# Altium schematic sheet AT long bus (13.3 x 4.2 inches).schdoc: AT long bus (13.3 x 4.2 inches)
size A4; Organization: Organization; Address1: Address1; Address2: Address2; Address3: Address3; Address4: Address4; DocumentNumber: 1; Revision: 0; SheetNumber: 2; SheetTotal: 2
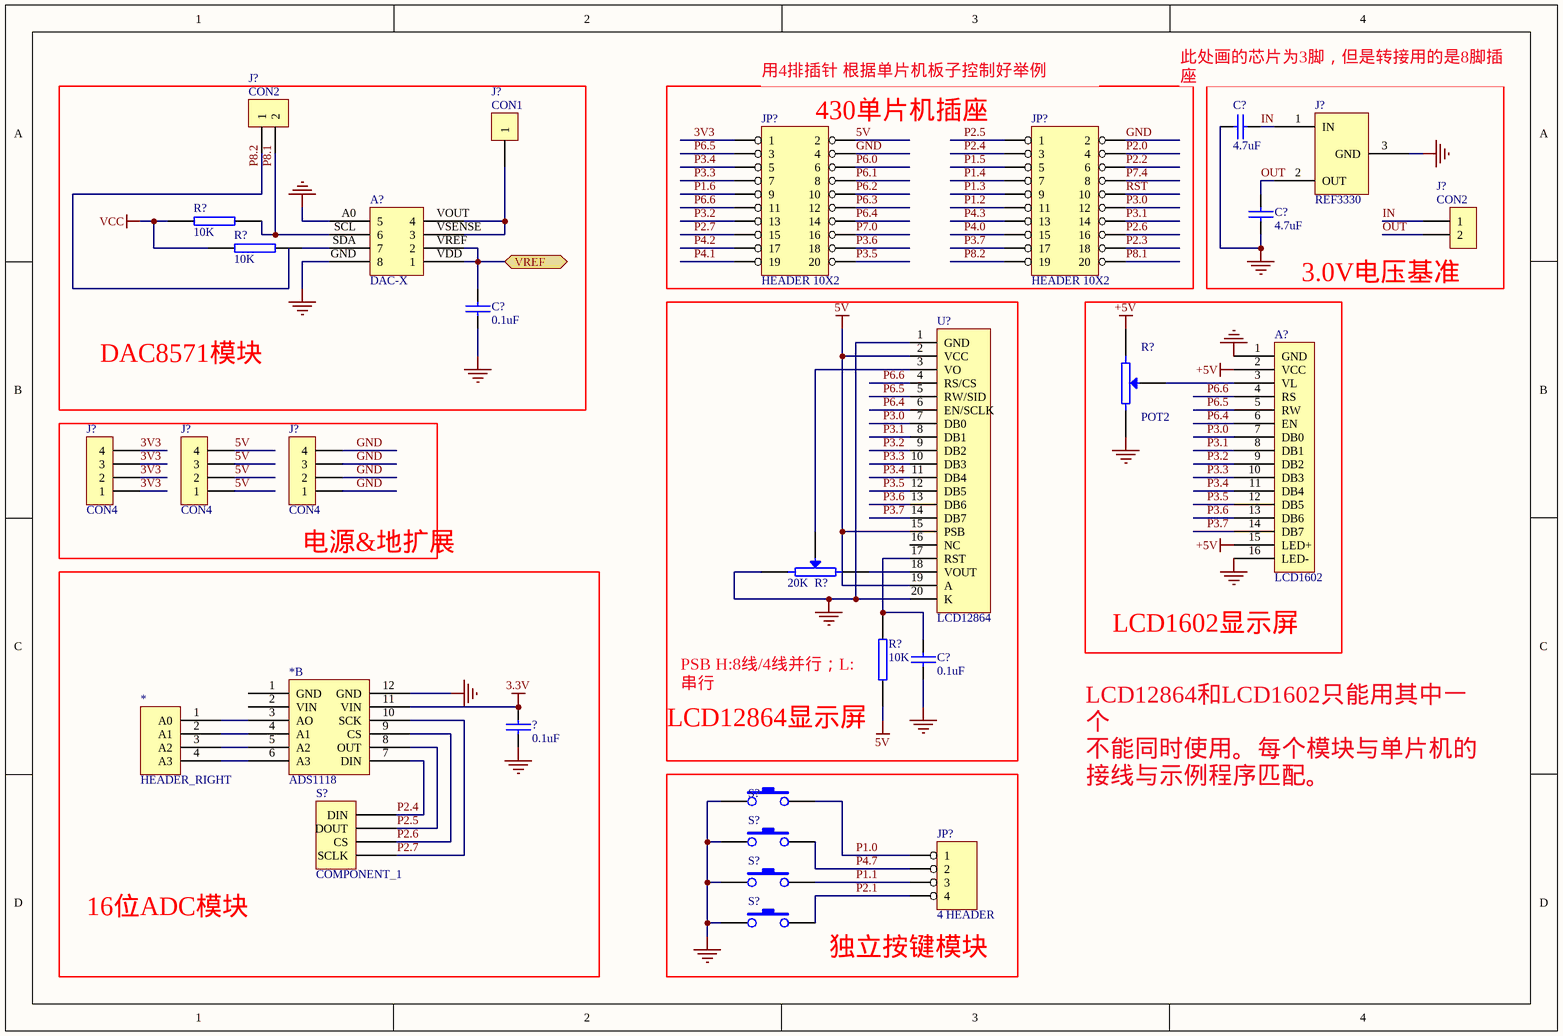
[diagram p0: AT long bus (13.3 x 4.2 inches).schdoc]

## Parts
(Parts that share a designator on the sheet are numbered #1, #2 ... from top to bottom, then left to right.)
*#1  HEADER_RIGHT
*#2  ADS1118  (part B of 2)
?  0.1uF
A?#1  DAC-X
A?#2  LCD1602  [SIP16]
C?#1  4.7uF
C?#2  4.7uF
C?#3  0.1uF
C?#4  0.1uF  [0805]
J?#1  REF3330
J?#2  CON2
J?#3  CON1
J?#4  CON2
J?#5  CON4
J?#6  CON4
J?#7  CON4
JP?#1  HEADER 10X2
JP?#2  HEADER 10X2
JP?#3  4 HEADER
R?#1  10K
R?#2  10K
R?#3  POT2  [VR5]
R?#4  20K  [VR5]
R?#5  10K  [0805]
S?#1  (no value)
S?#2  COMPONENT_1
S?#3  (no value)
S?#4  (no value)
S?#5  (no value)
U?  LCD12864  [SIP20]

## Ports
VREF

## Nets
3.3V: *#2.11(VIN) ?.1
5V: J?#6.1 J?#6.2 J?#6.3 J?#6.4 JP?#1.2 R?#5.2 U?.2(VCC) U?.15(PSB) U?.19(A)
+5V: A?#2.2(VCC) A?#2.15(LED+) R?#3.1
GND: A?#2.1(GND) A?#2.16(LED-) C?#1.1 C?#2.2 C?#4.2 J?#1.3(GND) J?#7.1 J?#7.2 J?#7.3 J?#7.4 JP?#1.4 JP?#2.2 R?#3.2 R?#4.1 S?#1.1 S?#3.1 S?#4.1 S?#5.1 U?.1(GND) U?.20(K)
VCC: *#2.12(GND) ?.2 A?#1.A0(5) A?#1.GND(8) C?#3.2 R?#1.1 R?#2.1
3V3: J?#5.1 J?#5.2 J?#5.3 J?#5.4 JP?#1.1
IN: C?#1.2 J?#1.1(IN) J?#4.1
OUT: C?#2.1 J?#1.2(OUT) J?#4.2
P1.0: JP?#3.1 S?#1.2
P1.1: JP?#3.3 S?#4.2
P1.2: JP?#2.11
P1.3: JP?#2.9
P1.4: JP?#2.7
P1.5: JP?#2.5
P1.6: JP?#1.9
P2.0: JP?#2.4
P2.1: JP?#3.4 S?#5.2
P2.2: JP?#2.6
P2.3: JP?#2.18
P2.4: *#2.7(DIN) JP?#2.3 S?#2.?1(DIN)
P2.5: *#2.8(OUT) JP?#2.1 S?#2.?2(DOUT)
P2.6: *#2.9(CS) JP?#2.16 S?#2.?3(CS)
P2.7: *#2.10(SCK) JP?#1.15 S?#2.?4(SCLK)
P3.0: A?#2.7(DB0) JP?#2.12 U?.7(DB0)
P3.1: A?#2.8(DB1) JP?#2.14 U?.8(DB1)
P3.2: A?#2.9(DB2) JP?#1.13 U?.9(DB2)
P3.3: A?#2.10(DB3) JP?#1.7 U?.10(DB3)
P3.4: A?#2.11(DB4) JP?#1.5 U?.11(DB4)
P3.5: A?#2.12(DB5) JP?#1.20 U?.12(DB5)
P3.6: A?#2.13(DB6) JP?#1.18 U?.13(DB6)
P3.7: A?#2.14(DB7) JP?#2.17 U?.14(DB7)
P4.0: JP?#2.15
P4.1: JP?#1.19
P4.2: JP?#1.17
P4.3: JP?#2.13
P4.7: JP?#3.2 S?#3.2
P6.0: JP?#1.6
P6.1: JP?#1.8
P6.2: JP?#1.10
P6.3: JP?#1.12
P6.4: A?#2.6(EN) JP?#1.14 U?.6(EN/SCLK)
P6.5: A?#2.5(RW) JP?#1.3 U?.5(RW/SID)
P6.6: A?#2.4(RS) JP?#1.11 U?.4(RS/CS)
P7.0: JP?#1.16
P7.4: JP?#2.8
P8.1: A?#1.SCL(6) J?#2.2 JP?#2.20 R?#1.2
P8.2: J?#2.1 JP?#2.19
RST: JP?#2.10
VREF: A?#1.VDD(1) A?#1.VREF(2) C?#3.1 ; port VREF
Net*#1_1: *#1.1(A0) *#2.3(AO)
Net*#1_2: *#1.2(A1) *#2.4(A1)
Net*#1_3: *#1.3(A2) *#2.5(A2)
Net*#1_4: *#1.4(A3) *#2.6(A3)
NetA?#1_SDA: A?#1.SDA(7) R?#2.2
NetA?#1_VOUT: A?#1.VOUT(4) A?#1.VSENSE(3) J?#3.1
NetA?#2_3: A?#2.3(VL) R?#3.3(W)
NetC?#4_1: C?#4.1 R?#5.1 U?.17(RST)
NetR?#4_2: R?#4.2 U?.18(VOUT)
NetR?#4_3: R?#4.3(W) U?.3(VO)

Not connected (* = marked no-connect by the designer): *#2 1(GND) 2(VIN); U? 16(NC)

## Notes on the sheet
- 用4排插针 根据单片机板子控制好举例
- 此处画的芯片为3脚，但是转接用的是8脚插座
- (near JP?#1) 430单片机插座
- 3.0V电压基准
- DAC8571模块
- (near J?#7) 电源&地扩展
- LCD1602显示屏
- (near R?#5) PSB H:8线/4线并行；L:串行
- LCD12864显示屏
- LCD12864和LCD1602只能用其中一个
  不能同时使用。每个模块与单片机的接线与示例程序匹配。
- 16位ADC模块
- 独立按键模块

## Library data of the parts
? C?#1-C?#4 = CAP: Capacitor
J?#2 J?#4 = CON2: Connector
J?#3 = CON1: Connector
J?#5-J?#7 = CON4: Connector
JP?#3 = 4 HEADER: 4 Pin Header
R?#1 R?#2 R?#5 = RES2
R?#3 R?#4 = POT2: Potentiometer
S?#1 S?#3-S?#5 = SW-PB
S?#2 = ADS1118